# EAGLE schematic rt_hirose_breakout (EAGLE 6.5.0)
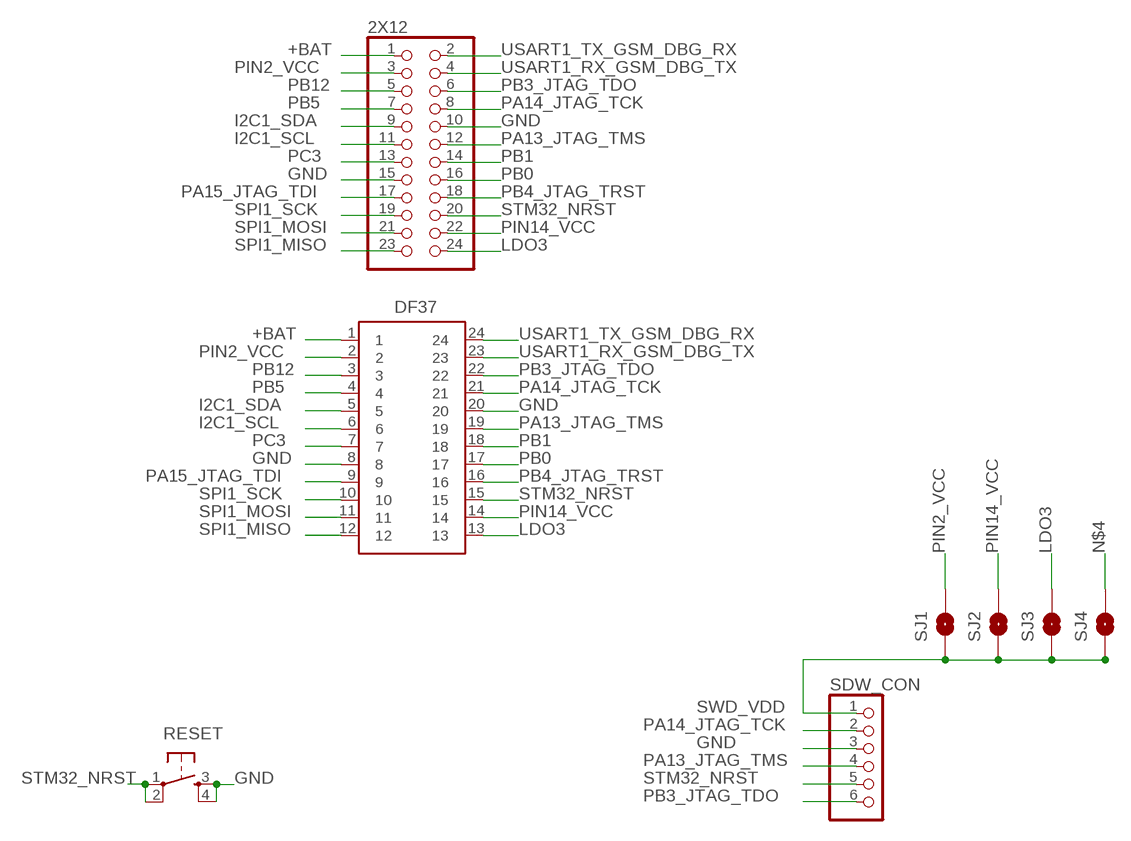
[diagram p0: schematic, sheet 1]

## Parts
2X12  PINHD-2X12  [2X12]
DF37  DF37-24-HEADER  [DF37-24-HEADER]
RESET  TAC_SWITCHSMD  [TACTILE_SWITCH_SMD]
SDW_CON  PINHD-1X6  [1X06]
SJ1  SOLDERJUMPERNO  [SJ_2S-NO]
SJ2  SOLDERJUMPERNO  [SJ_2S-NO]
SJ3  SOLDERJUMPERNO  [SJ_2S-NO]
SJ4  SOLDERJUMPERNO  [SJ_2S-NO]

## Nets
+BAT: 2X12.1 DF37.1
GND: 2X12.10 2X12.15 DF37.8 DF37.20 RESET.3 RESET.4 SDW_CON.3
I2C1_SCL: 2X12.11 DF37.6
I2C1_SDA: 2X12.9 DF37.5
LDO3: 2X12.24 DF37.13 SJ3.2
N$4: SJ4.2
PA13_JTAG_TMS: 2X12.12 DF37.19 SDW_CON.4
PA14_JTAG_TCK: 2X12.8 DF37.21 SDW_CON.2
PA15_JTAG_TDI: 2X12.17 DF37.9
PB0: 2X12.16 DF37.17
PB1: 2X12.14 DF37.18
PB3_JTAG_TDO: 2X12.6 DF37.22 SDW_CON.6
PB4_JTAG_TRST: 2X12.18 DF37.16
PB5: 2X12.7 DF37.4
PB12: 2X12.5 DF37.3
PC3: 2X12.13 DF37.7
PIN2_VCC: 2X12.3 DF37.2 SJ1.2
PIN14_VCC: 2X12.22 DF37.14 SJ2.2
SPI1_MISO: 2X12.23 DF37.12
SPI1_MOSI: 2X12.21 DF37.11
SPI1_SCK: 2X12.19 DF37.10
STM32_NRST: 2X12.20 DF37.15 RESET.1 RESET.2 SDW_CON.5
SWD_VDD: SDW_CON.1 SJ1.1 SJ2.1 SJ3.1 SJ4.1
USART1_RX_GSM_DBG_TX: 2X12.4 DF37.23
USART1_TX_GSM_DBG_RX: 2X12.2 DF37.24

## Library data of the parts
2X12 = pinhead:PINHD-2X12: PIN HEADER
DF37 = hirose_df37:DF37-24-HEADER
RESET = SparkFun-Electromechanical:TAC_SWITCH: Momentary Switch Button commonly used for reset or general input. Spark Fun Electronics SKU : COM-00097 SMT- SWCH-08247; PROD_ID: SWCH-08247
SDW_CON = pinhead:PINHD-1X6: PIN HEADER
SJ1-SJ4 = SparkFun-Passives:SOLDERJUMPER: Solder Jumper Standard SMD solder jumper. Used to automate production. Two varients : Normally Open and Normally Closed are the same, but have different paste layers. NC will have a large amount of paste and should jumper during reflow.